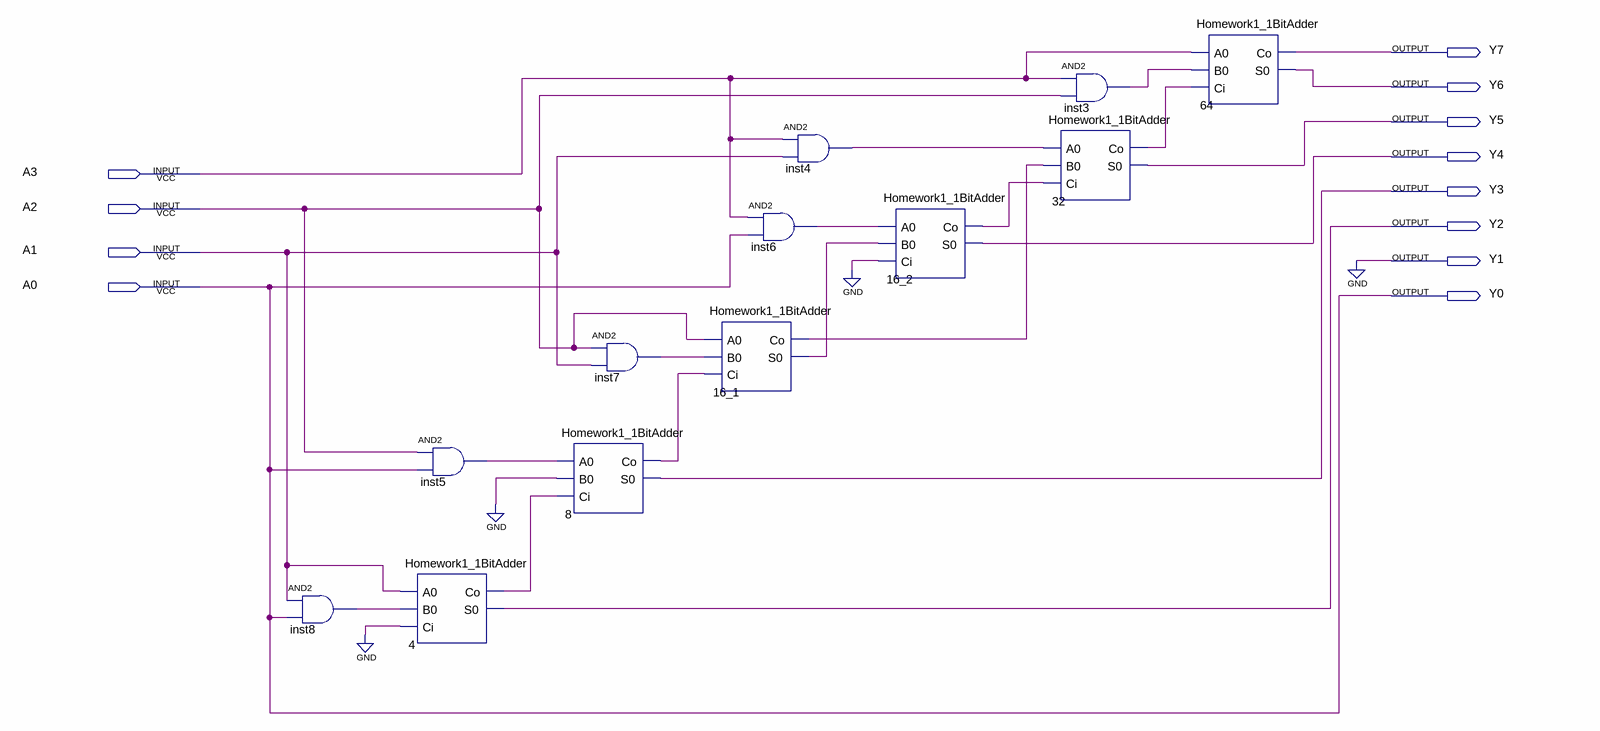
[diagram p0: schematic sheet]
// Quartus schematic Homework1_4BitSquarer.bdf as structural Verilog: 12 symbols, 12 pins
module Homework1_4BitSquarer (
  input  A3,
  input  A2,
  input  A1,
  input  A0,
  output Y7,
  output Y6,
  output Y5,
  output Y4,
  output Y3,
  output Y2,
  output Y1,
  output Y0
);

  wire inst3_out, inst4_out, inst5_out, inst6_out, inst7_out, inst8_out, n4_co, n8_co, n16_1_co, n16_1_s0,
       n16_2_co, n32_co;

  and inst8 (inst8_out, A1, A0);
  and inst5 (inst5_out, A2, A0);
  Homework1_1BitAdder u_4 (.A0(A1), .B0(inst8_out), .Ci(1'b0), .Co(n4_co), .S0(Y2));
  Homework1_1BitAdder u_8 (.A0(inst5_out), .B0(1'b0), .Ci(n4_co), .Co(n8_co), .S0(Y3));
  and inst7 (inst7_out, A2, A1);
  Homework1_1BitAdder u_16_1 (.A0(A2), .B0(inst7_out), .Ci(n8_co), .Co(n16_1_co), .S0(n16_1_s0));
  and inst6 (inst6_out, A3, A0);
  and inst4 (inst4_out, A3, A1);
  Homework1_1BitAdder u_16_2 (.A0(inst6_out), .B0(n16_1_s0), .Ci(1'b0), .Co(n16_2_co), .S0(Y4));
  Homework1_1BitAdder u_32 (.A0(inst4_out), .B0(n16_1_co), .Ci(n16_2_co), .Co(n32_co), .S0(Y5));
  and inst3 (inst3_out, A3, A2);
  Homework1_1BitAdder u_64 (.A0(A3), .B0(inst3_out), .Ci(n32_co), .Co(Y7), .S0(Y6));

  assign Y0 = A0;
  assign Y1 = 1'b0;
endmodule
